# Altium schematic sheet Block_Diagram.SchDoc
size Letter; Website: www.uwmidsun.com
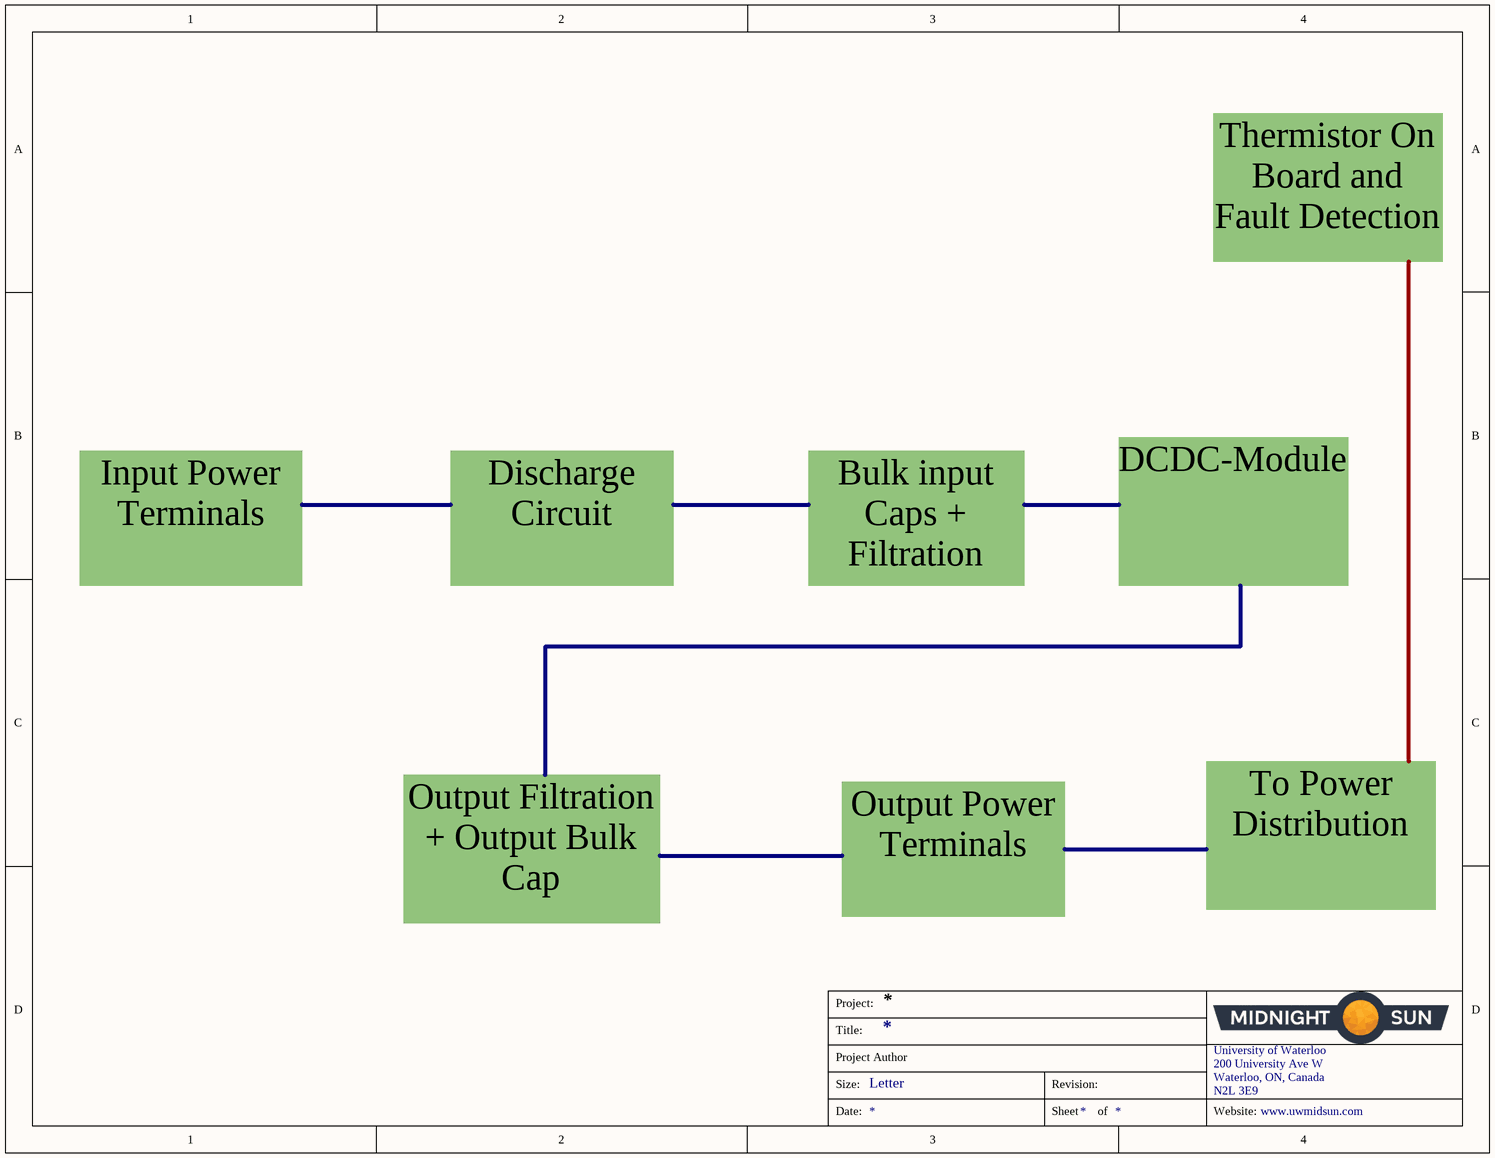
[diagram p0: Block_Diagram.SchDoc]

## Notes on the sheet
- Thermistor On Board and Fault Detection
- Input Power Terminals
- Discharge Circuit
- Bulk input Caps + Filtration
- DCDC-Module
- Output Power Terminals
- To Power Distribution
- Output Filtration + Output Bulk Cap
- Project:
- Title:
- Size:
- Project Author
- Letter
- Revision:
- University of Waterloo
- 200 University Ave W
- Waterloo, ON, Canada
- N2L 3E9
- Date:
- Sheet
- of
- Website: